# Altium schematic sheet CH340G.SchDoc
size A4
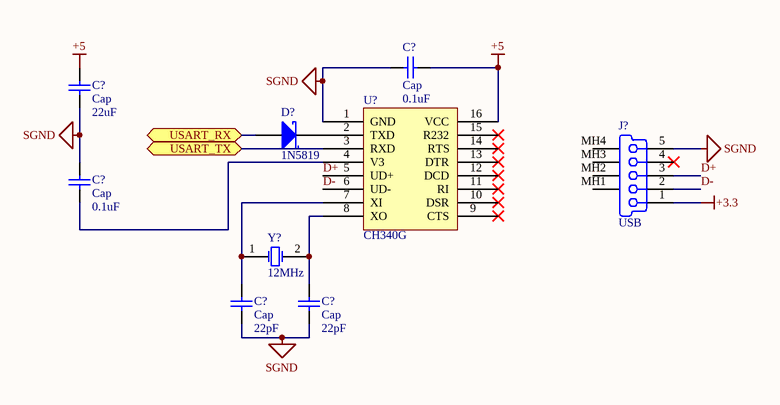
[diagram p0: CH340G.SchDoc]

## Parts
(Parts that share a designator on the sheet are numbered #1, #2 ... from top to bottom, then left to right.)
C?#1  Cap  value 0.1uF  [1206]
C?#2  Cap  value 22uF  [1206]
C?#3  Cap  value 0.1uF  [1206]
C?#4  Cap  value 22pF  [1206]
C?#5  Cap  value 22pF  [1206]
D?  Type: 1N5819  [SMA DO214AC]  (hidden comment: D-Schottky)
J?  USB
U?  CH340G  [CH340G]
Y?  12MHz  [XTAL]

## Ports
USART_RX (bidir), USART_TX (bidir)

## Nets
+3.3: J?.1(V_BUS_(5V))
+5: C?#1.2 C?#2.2 U?.16(VCC)
SGND: C?#1.1 C?#2.1 C?#3.2 C?#4.1 C?#5.1 J?.5(GND) U?.1(GND)
D+: J?.3(D+) U?.5(UD+)
D-: J?.2(D-) U?.6(UD-)
USART_RX: D?.1(A) ; port USART_RX
USART_TX: U?.3(RXD) ; port USART_TX
NetC?#3_1: C?#3.1 U?.4(V3)
NetC?#4_2: C?#4.2 U?.7(XI) Y?.1(OSC1)
NetC?#5_2: C?#5.2 U?.8(XO) Y?.2(OSC2)
NetD?_2: D?.2(K) U?.2(TXD)

Not connected (* = marked no-connect by the designer): J? 4(NC)* MH1(Tab) MH2(Tab) MH3(Tab) MH4(Tab); U? 9(CTS)* 10(DSR)* 11(RI)* 12(DCD)* 13(DTR)* 14(RTS)* 15(R232)*

## Library data of the parts
C?#1-C?#5 = Cap: Capacitor; Published: 8-Jun-2000; LatestRevisionDate: 17-Jul-2002; LatestRevisionNote: Re-released for DXP Platform.; PackageReference: RAD-0.3; Publisher: Altium Limited; PackageDescription: Radial Cap, Thru-Hole; 2 Leads; 0.3 in Pin Spacing
D? = D-Schottky: 肖特基二极管; Published: 8-Jun-2000; LatestRevisionDate: 17-Jul-2002; LatestRevisionNote: Re-released for DXP Platform.; PackageReference: SMB; Publisher: Altium Limited; Code_JEDEC: DO-214-AA
J? = USB: USB On-The-Go (OTG) Mini-B Receptacle, Right Angle, SMT, 0.80mm (.031") Pitch, Solder Tabs with Back Cover, Recessed Type; PCB_Layout: Complies with Manufacturer's Recommendation.; Published: 21-Sep-2007; DatasheetVersion: revA, May-2004; PackageVersion: May-2004; PackageReference: 481900001; Publisher: Altium Limited; PackageDescription: USB Mini-B, Sinking Type, SM; 5 Position; Right Angle, Body 11.45 x 11.8 x 3.9 mm (LxWxH); ComponentLink1Description: Manufacturer Link; ComponentLink1URL: http://www.molex.com/; ComponentLink2Description: Datasheet; ComponentLink2URL: http://www.molex.com/cmc_upload/0/000/895/958/SD-48190-001RevA.pdf
Y? = XTAL: Crystal Oscillator; Published: 8-Jun-2000; LatestRevisionDate: 17-Jul-2002; LatestRevisionNote: Re-released for DXP Platform.; PackageReference: R38; Publisher: Altium Limited; PackageDescription: Crystal, Thru-Hole; 2 Leads; Body 3.1 x 8.2 mm (Dia.xH)